# EAGLE design Murray (EAGLE 7.7.0)
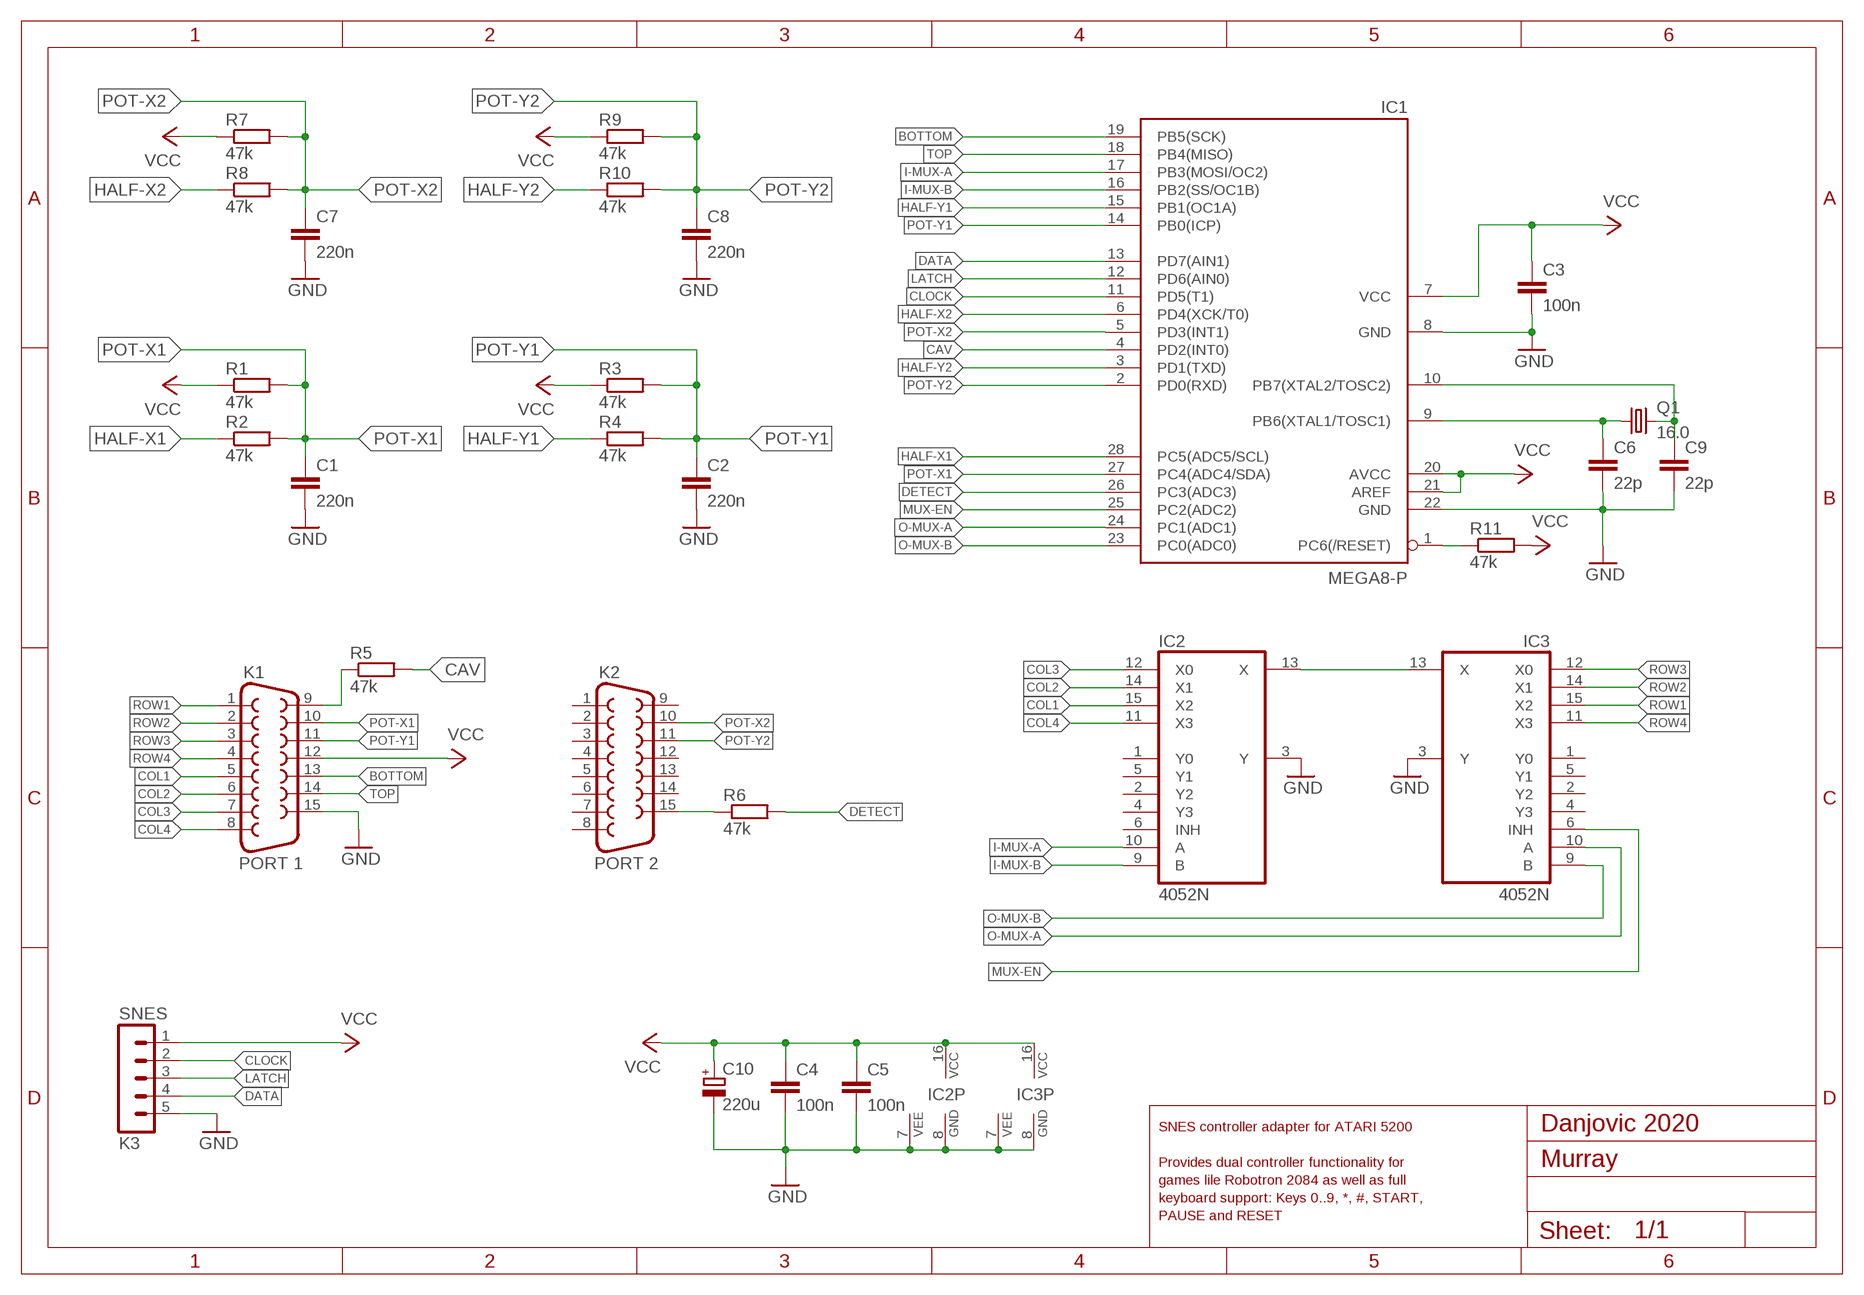
[diagram p0: schematic, sheet 1]

## Parts
C1  220n  C-EU050-030X075  [C050-030X075]
C2  220n  C-EU050-030X075  [C050-030X075]
C3  100n  C-EU050-024X044  [C050-024X044]
C4  100n  C-EU050-024X044  [C050-024X044]
C5  100n  C-EU050-024X044  [C050-024X044]
C6  22p  C-EU025-024X044  [C025-024X044]
C7  220n  C-EU050-030X075  [C050-030X075]
C8  220n  C-EU050-030X075  [C050-030X075]
C9  22p  C-EU025-024X044  [C025-024X044]
C10  220u  CPOL-EUE2,5-6E  [E2,5-6E]
IC1  MEGA8-P  [DIL28-3]
IC2  4052N  [DIL16]
IC3  4052N  [DIL16]
K1  PORT 1  F15H  [F15H]
K2  PORT 2  F15H  [F15H]
K3  SNES  MA05-1  [MA05-1]
Q1  16.0  CRYSTALTC26V  [TC26V]
R1  47k  R-EU_0204/7  [0204/7]
R2  47k  R-EU_0204/7  [0204/7]
R3  47k  R-EU_0204/7  [0204/7]
R4  47k  R-EU_0204/7  [0204/7]
R5  47k  R-EU_0204/7  [0204/7]
R6  47k  R-EU_0204/7  [0204/7]
R7  47k  R-EU_0204/7  [0204/7]
R8  47k  R-EU_0204/7  [0204/7]
R9  47k  R-EU_0204/7  [0204/7]
R10  47k  R-EU_0204/7  [0204/7]
R11  47k  R-EU_0204/7  [0204/7]

## Nets
BOTTOM: IC1.19(PB5(SCK)) K1.13
CAV: IC1.4(PD2(INT0)) R5.2
CLOCK: IC1.11(PD5(T1)) K3.2
COL1: IC2.15(X2) K1.5
COL2: IC2.14(X1) K1.6
COL3: IC2.12(X0) K1.7
COL4: IC2.11(X3) K1.8
DATA: IC1.13(PD7(AIN1)) K3.4
DETECT: IC1.26(PC3(ADC3)) R6.2
GND: C1.2 C2.2 C3.2 C4.2 C5.2 C6.2 C7.2 C8.2 C9.2 C10.- IC1.8(GND) IC1.22(GND) IC2.3(Y) IC2.7(VEE) IC2.8(GND) IC3.3(Y) IC3.7(VEE) IC3.8(GND) K1.15 K3.5
HALF-X1: IC1.28(PC5(ADC5/SCL)) R2.1
HALF-X2: IC1.6(PD4(XCK/T0)) R8.1
HALF-Y1: IC1.15(PB1(OC1A)) R4.1
HALF-Y2: IC1.3(PD1(TXD)) R10.1
I-MUX-A: IC1.17(PB3(MOSI/OC2)) IC2.10(A)
I-MUX-B: IC1.16(PB2(SS/OC1B)) IC2.9(B)
LATCH: IC1.12(PD6(AIN0)) K3.3
MUX-EN: IC1.25(PC2(ADC2)) IC3.6(INH)
N$1: K2.15 R6.1
N$2: IC2.13(X) IC3.13(X)
N$3: IC1.1(PC6(/RESET)) R11.1
N$19: K1.9 R5.1
O-MUX-A: IC1.24(PC1(ADC1)) IC3.10(A)
O-MUX-B: IC1.23(PC0(ADC0)) IC3.9(B)
POT-X1: C1.1 IC1.27(PC4(ADC4/SDA)) K1.10 R1.2 R2.2
POT-X2: C7.1 IC1.5(PD3(INT1)) K2.10 R7.2 R8.2
POT-Y1: C2.1 IC1.14(PB0(ICP)) K1.11 R3.2 R4.2
POT-Y2: C8.1 IC1.2(PD0(RXD)) K2.11 R9.2 R10.2
ROW1: IC3.15(X2) K1.1
ROW2: IC3.14(X1) K1.2
ROW3: IC3.12(X0) K1.3
ROW4: IC3.11(X3) K1.4
TOP: IC1.18(PB4(MISO)) K1.14
VCC: C3.1 C4.1 C5.1 C10.+ IC1.7(VCC) IC1.20(AVCC) IC1.21(AREF) IC2.16(VCC) IC3.16(VCC) K1.12 K3.1 R1.1 R3.1 R7.1 R9.1 R11.2
XT1: C6.1 IC1.9(PB6(XTAL1/TOSC1)) Q1.1
XT2: C9.1 IC1.10(PB7(XTAL2/TOSC2)) Q1.2
Unconnected: IC2.1(Y0) IC2.2(Y2) IC2.4(Y3) IC2.5(Y1) IC2.6(INH) IC3.1(Y0) IC3.2(Y2) IC3.4(Y3) IC3.5(Y1) K2.1 K2.2 K2.3 K2.4 K2.5 K2.6 K2.7 K2.8 K2.9 K2.12 K2.13 K2.14

## Notes on the sheet
- SNES controller adapter for ATARI 5200 | Danjovic 2020
- Provides dual controller functionality for
- games lile Robotron 2084 as well as full
- keyboard support: Keys 0..9, *, #, START,
- PAUSE and RESET

## Library data of the parts
C1-C9 = rcl:C-EU: CAPACITOR, European symbol
C10 = rcl:CPOL-EU: POLARIZED CAPACITOR, European symbol
IC1 = atmel:MEGA8-P: MICROCONTROLLER 8 Kbytes FLASH, 1 kbytes SRAM, 512 bytes EEPROM, USART, 4-channel 10 bit ADC, 2-channel 8 bit ADC Pin compatible with Atmega48, ATMega88, ATMega168 Source: avr.lbr; OC_FARNELL: unknown; OC_NEWARK: unknown
IC2 IC3 = 40xx:4052: Dual 4-channel ANALOG MULTIPLEXER
K1 K2 = con-subd:F15: SUB-D; OC_FARNELL: unknown; OC_NEWARK: unknown
K3 = con-lstb:MA05-1: PIN HEADER; OC_FARNELL: unknown; OC_NEWARK: unknown
Q1 = crystal:CRYSTAL: CRYSTAL; OC_FARNELL: unknown; OC_NEWARK: unknown
R1-R11 = rcl:R-EU_: RESISTOR, European symbol

## Board
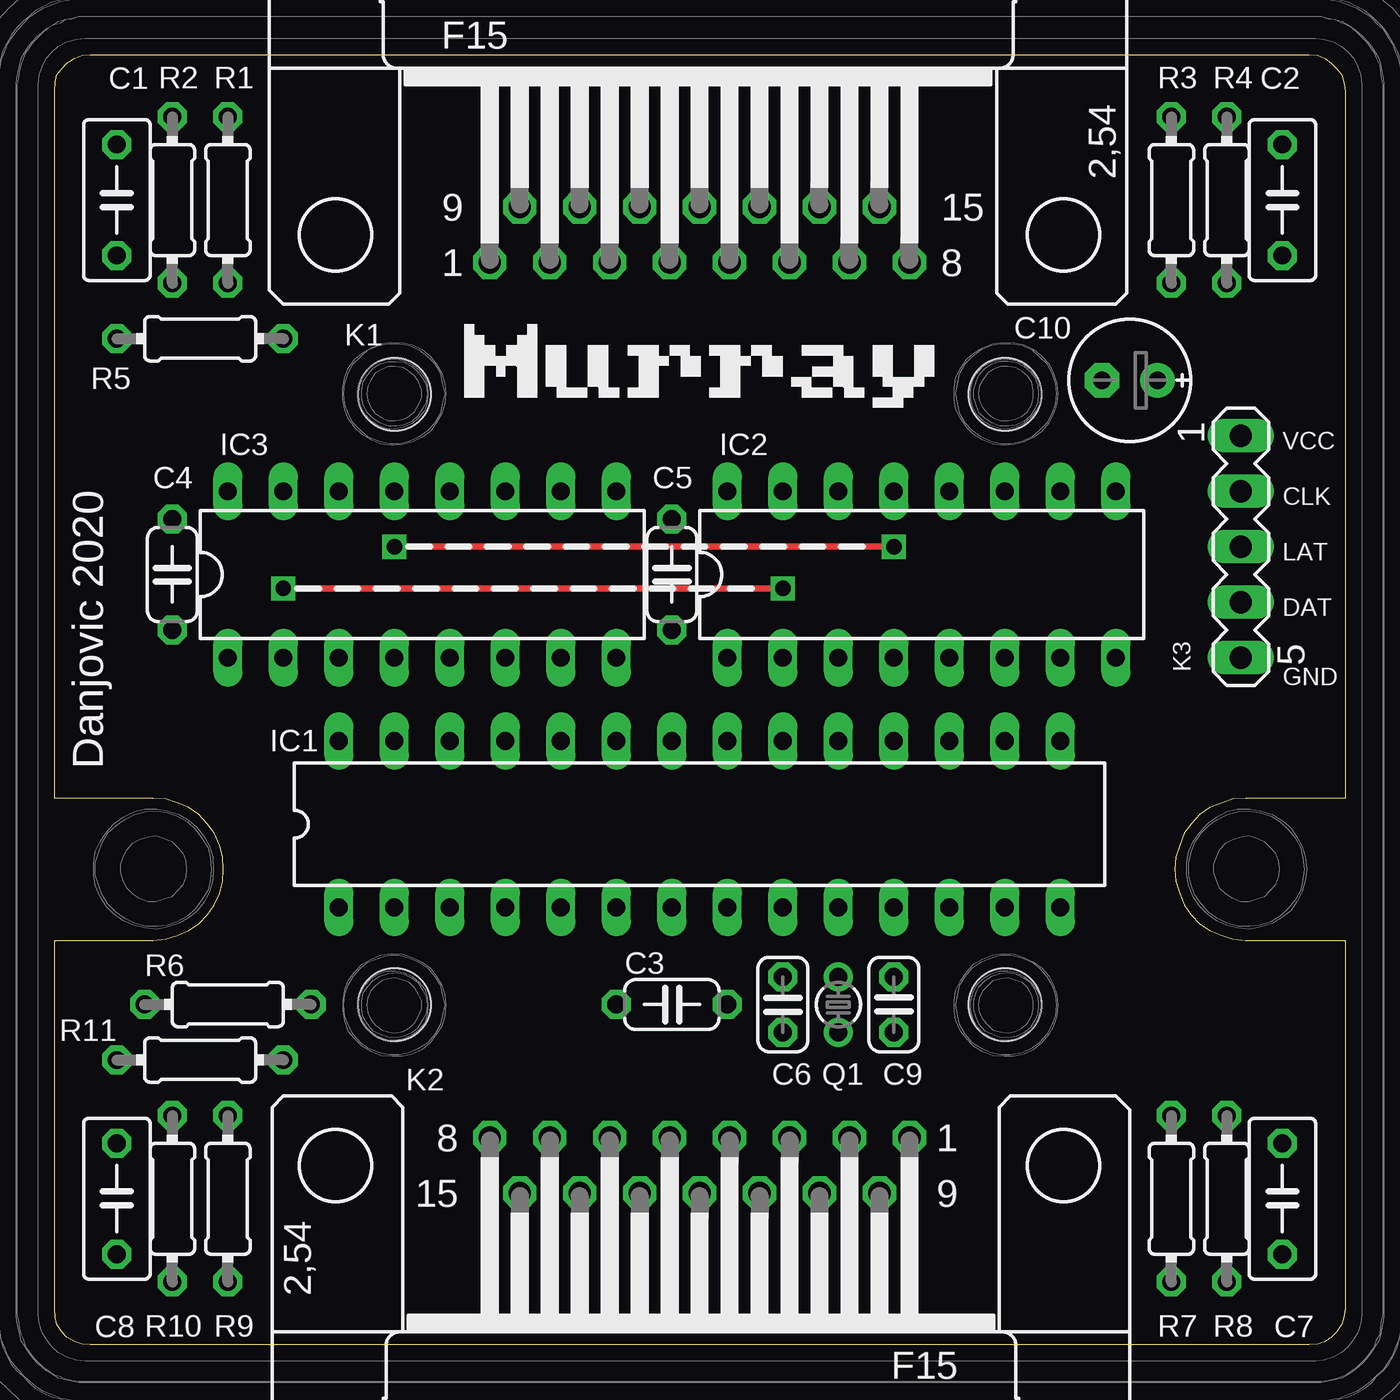
[diagram p1: board, top side]
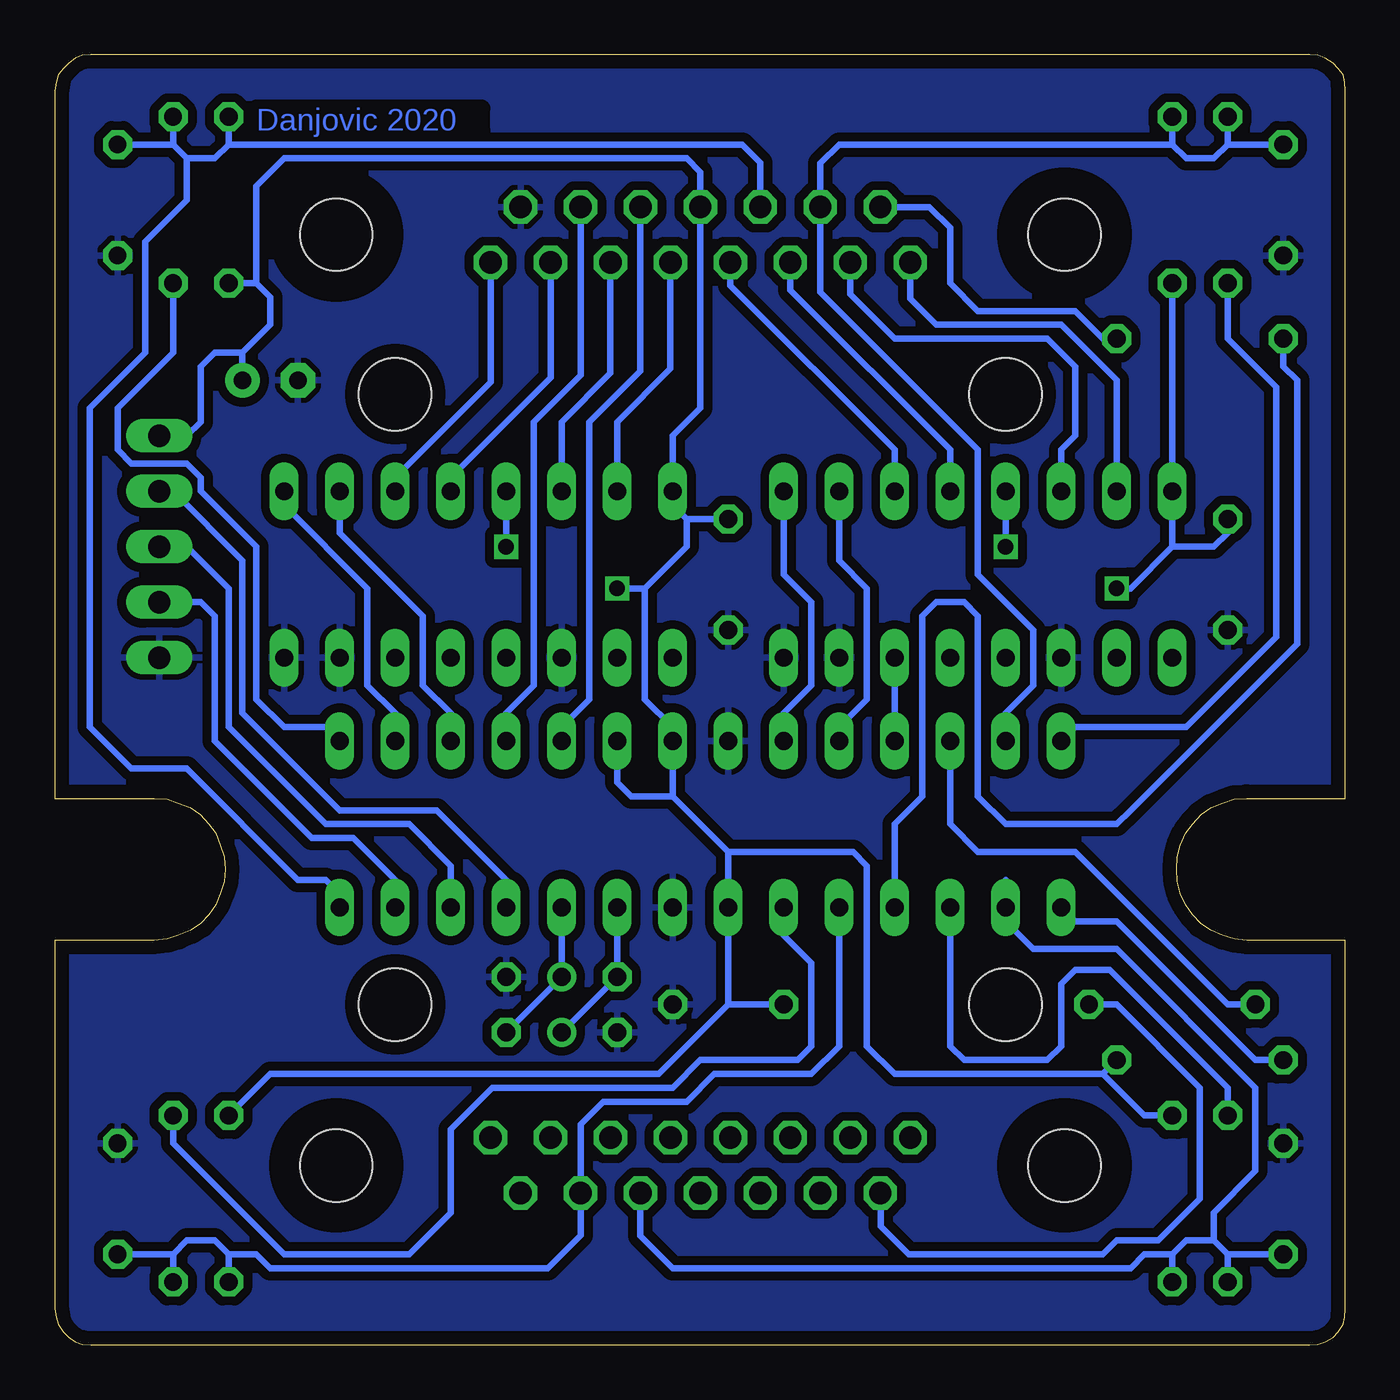
[diagram p2: board, bottom side, seen from below]

Size 59.07 x 59.07 mm. Coordinates in mm from the lower left corner, seen from the top.
Copper layers (1*16): Top 0.035mm / dielectric 1.5mm / Bottom 0.035mm
Design rules "default *": minimum track width 10mil, minimum drill 24mil, track to track 8mil, track to pad 8mil, pad to pad 8mil, via to via 8mil, smd to smd 8mil, copper to edge 25mil, drill to drill 8mil, minimum pad ring 10mil, minimum via ring 8mil, stop-mask expansion 4mil, vias tented up to drill 0mil, thermal gap 10mil

### Footprints (pad centres in the part's own frame; a part is rotated, then mirrored left to right if it is on the bottom)
C050-030X075 = drill 0.813 octagon: 1 -2.54,0; 2 2.54,0
C050-024X044 = drill 0.813 octagon: 1 -2.54,0; 2 2.54,0
C025-024X044 = drill 0.813 octagon: 1 -1.27,0; 2 1.27,0
E2,5-6E = drill 0.813 pad 1.575: + -1.27,0 | drill 0.813 pad 1.575 octagon: - 1.27,0
DIL28-3 = drill 0.813 long: 1 -16.51,-3.81; 2 -13.97,-3.81; 3 -11.43,-3.81; 4 -8.89,-3.81; 5 -6.35,-3.81; 6 -3.81,-3.81; 7 -1.27,-3.81; 8 1.27,-3.81; 9 3.81,-3.81; 10 6.35,-3.81; 11 8.89,-3.81; 12 11.43,-3.81; 13 13.97,-3.81; 14 16.51,-3.81; 15 16.51,3.81; 16 13.97,3.81; 17 11.43,3.81; 18 8.89,3.81; 19 6.35,3.81; 20 3.81,3.81; 21 1.27,3.81; 22 -1.27,3.81; 23 -3.81,3.81; 24 -6.35,3.81; 25 -8.89,3.81; 26 -11.43,3.81; 27 -13.97,3.81; 28 -16.51,3.81
DIL16 = drill 0.813 long: 1 -8.89,-3.81; 2 -6.35,-3.81; 3 -3.81,-3.81; 4 -1.27,-3.81; 5 1.27,-3.81; 6 3.81,-3.81; 7 6.35,-3.81; 8 8.89,-3.81; 9 8.89,3.81; 10 6.35,3.81; 11 3.81,3.81; 12 1.27,3.81; 13 -1.27,3.81; 14 -3.81,3.81; 15 -6.35,3.81; 16 -8.89,3.81
F15H = drill 1.016 octagon: 1 -9.601,-1.27; 2 -6.858,-1.27; 3 -4.115,-1.27; 4 -1.372,-1.27; 5 1.372,-1.27; 6 4.115,-1.27; 7 6.858,-1.27; 8 9.601,-1.27; 9 -8.23,1.27; 10 -5.486,1.27; 11 -2.743,1.27; 12 0,1.27; 13 2.743,1.27; 14 5.486,1.27; 15 8.23,1.27 | hole 3.302: -16.662,0; 16.662,0
MA05-1 = drill 1.016 long: 1 -5.08,0; 2 -2.54,0; 3 0,0; 4 2.54,0; 5 5.08,0
TC26V = drill 0.813: 1 -1.27,0; 2 1.27,0
0204/7 = drill 0.813 octagon: 1 -3.81,0; 2 3.81,0
1593J = hole 3.302: -13.97,-13.97; 13.97,-13.97; -13.97,13.97; 13.97,13.97

### Placement (x,y rotation side)
C1  2.85,52.41 270 top
C2  56.19,52.41 270 top
C3  28.25,15.58 0 top
C4  5.39,35.27 270 top
C5  28.25,35.27 270 top
C6  33.33,15.58 270 top
C7  56.19,6.69 90 top
C8  2.85,6.69 90 top
C9  38.41,15.58 90 top
C10  49.2,44.16 180 top
IC1  29.52,23.84 0 top
IC2  39.68,35.27 0 top
IC3  16.82,35.27 0 top
K1  29.52,50.82 0 top
K2  29.52,8.22 180 top
K3  54.28,36.54 270 top
Q1  35.87,15.58 90 top
R1  7.93,52.41 90 top
R2  5.39,52.41 90 top
R3  51.11,52.41 90 top
R4  53.65,52.41 90 top
R5  6.66,46.06 180 top
R6  7.93,15.58 180 top
R7  51.11,6.69 270 top
R8  53.65,6.69 270 top
R9  7.93,6.69 270 top
R10  5.39,6.69 270 top
R11  6.66,13.04 0 top
U$1  [1593J]  29.52,29.55 0 top

### Tracks (layer width: path | path; a pad name or v marks a point on that pad's centre or on a via)
BOTTOM
  Bottom 0.305: K1.13 32.26,44.59 34.6,42.25 34.6,29.55 35.87,28.28 IC1.19
CAV
  Bottom 0.305: R5.2 2.85,44.79 2.21,44.16 2.21,32.09 9.83,24.47 10.47,23.84 15.55,23.84 16.82,25.11 16.82,33.36 17.45,34 18.72,34 19.36,33.36 19.36,25.11 20.63,23.84 IC1.4
CLOCK
  Bottom 0.305: K3.2 53.65,39.08 50.47,35.9 50.47,28.92 46.03,24.47 41.58,24.47 38.41,21.3 IC1.11
COL1
  Bottom 0.305: K1.5 30.89,44.69 33.33,42.25 IC2.15
COL2
  Bottom 0.305: K1.6 33.63,44.49 35.87,42.25 IC2.14
COL3
  Bottom 0.305: K1.7 36.38,44.28 40.95,39.71 IC2.12
COL4
  Bottom 0.305: K1.8 39.12,44.08 43.49,39.71 IC2.11
DATA
  Bottom 0.305: K3.4 52.38,34 51.74,33.36 51.74,27.65 47.3,23.2 45.39,23.2 43.49,21.3 IC1.13
DETECT
  Bottom 0.305: IC1.26 18.09,23.84 16.82,22.57 12.37,22.57 5.39,15.58 R6.2
GND
  pour Bottom (isolate 0.406): -0.96,-0.93 -0.96,60.03 60,60.03 60,-0.93
HALF-X1
  Bottom 0.305: R2.1 5.39,46.06 3.17,43.84 3.17,32.41 7.29,28.28 12.37,28.28 IC1.28
HALF-X2
  Bottom 0.305: IC1.6 25.71,18.76 24.44,17.49 24.44,13.68 25.07,13.04 29.52,13.04 30.79,11.77 39.04,11.77 40.95,9.87 40.95,6.06 42.85,4.15 48.57,4.15 53.65,9.23 R8.1
HALF-Y1
  Bottom 0.305: R4.1 53.65,45.43 56.19,42.89 56.19,40.98 55.55,40.35 53.01,40.35 52.38,39.71 52.38,39.08 49.84,36.54 49.84,29.55 48.57,28.28 46.66,28.28 IC1.15 46.03,27.01
HALF-Y2
  Bottom 0.305: IC1.3 18.09,13.68 17.45,13.04 13.64,13.04 13.01,13.68 13.01,16.53 12.37,17.17 10.79,17.17 5.39,11.77 R10.1
I-MUX-A
  Bottom 0.305: IC1.17 40.95,28.92 42.22,30.19 42.22,33.36 46.03,37.17 IC2.10
I-MUX-B
  Bottom 0.305: IC2.9 48.57,38.44 44.76,34.63 44.76,30.19 43.49,28.92 IC1.16
LATCH
  Bottom 0.305: K3.3 53.01,36.54 51.11,34.63 51.11,28.28 46.66,23.84 42.85,23.84 40.95,21.93 IC1.12
MUX-EN
  Bottom 0.305: IC3.6 IC1.25
N$1
  Bottom 0.305: K2.15 21.26,6.92 21.26,5.42 20.63,4.79 19.99,4.15 11.1,4.15 10.47,4.79 8.56,4.79 6.66,6.69 6.66,11.77 10.47,15.58 R6.1
N$2  (via drill 0.7)
  Top 0.305: v15.55,36.54 v38.41,36.54
  Bottom 0.305: IC3.13 v15.55,36.54 | v38.41,36.54 IC2.13
N$3
  Bottom 0.305: IC1.1 12.37,19.39 10.47,19.39 4.12,13.04 R11.1
N$19
  Bottom 0.305: R5.1 11.1,46.06 12.37,47.33 16.82,47.33 18.09,48.6 18.09,51.14 19.04,52.09 K1.9
O-MUX-A
  Bottom 0.305: IC3.10 23.17,35.9 21.9,34.63 21.9,29.55 23.17,28.28 IC1.24
O-MUX-B
  Bottom 0.305: IC3.9 25.71,35.27 24.44,34 24.44,30.19 25.71,28.92 IC1.23
POT-X1
  Bottom 0.305: R2.2 5.39,54.95 | 5.39,54.95 C1.1 | R1.2 7.93,54.95 | 7.93,54.95 7.29,54.32 6.02,54.32 5.39,54.95 | 7.93,54.95 23.17,54.95 24.03,54.09 K1.10 24.03,48.2 16.82,40.98 16.82,35.27 14.28,32.73 14.28,30.19 15.55,28.92 IC1.27
POT-X2
  Bottom 0.305: C7.1 53.65,4.15 | 53.65,4.15 R8.2 | R7.2 51.11,4.15 | 51.11,4.15 51.74,4.79 53.01,4.79 53.65,4.15 | 51.11,4.15 49.84,4.15 49.2,3.52 36.5,3.52 35.87,4.15 35,5.02 K2.10 35,10.1 33.96,11.14 30.15,11.14 28.88,12.41 24.44,12.41 23.17,13.68 IC1.5
POT-Y1
  Bottom 0.305: C2.1 53.65,54.95 | 53.65,54.95 R4.2 | R3.2 51.11,54.95 | 51.11,54.95 51.74,54.32 53.01,54.32 | 53.01,54.32 53.65,54.95 | 51.11,54.95 27.61,54.95 26.77,54.11 K1.11 | 53.01,54.32 53.01,52.41 54.92,50.51 54.92,45.43 57.46,42.89 57.46,28.28 55.55,26.38 53.01,26.38 47.93,21.3 46.66,21.3 46.03,20.66 IC1.14
POT-Y2
  Bottom 0.305: C8.1 5.39,4.15 | 7.93,4.15 7.29,4.79 6.02,4.79 | 6.02,4.79 5.39,4.15 | 7.93,4.15 9.2,4.15 9.83,3.52 30.79,3.52 32.26,4.99 K2.11 | 15.55,21.3 IC1.2 15.55,19.39 14.28,18.12 10.47,18.12 4.12,11.77 4.12,7.96 6.02,6.06 6.02,4.79 | R10.2 5.39,4.15 | 7.93,4.15 R9.2
ROW1
  Bottom 0.305: IC3.15 10.47,44.16 13.01,46.7 18.72,46.7 19.92,47.89 K1.1
ROW2
  Bottom 0.305: K1.2 22.66,48.09 20.63,46.06 13.64,46.06 12.37,44.79 12.37,41.62 13.01,40.98 IC3.14
ROW3
  Bottom 0.305: IC3.12 18.09,40.98 25.4,48.3 K1.3
ROW4
  Bottom 0.305: K1.4 28.15,48.5 20.63,40.98 IC3.11
TOP
  Bottom 0.305: K1.14 35,44.39 37.14,42.25 37.14,30.19 38.41,28.92 IC1.18
VCC  (via drill 0.7)
  Top 0.305: v10.47,34.63 v33.33,34.63
  Bottom 0.305: C5.1 30.15,37.81 | 30.15,37.81 30.79,38.44 IC2.16 30.79,41.62 29.52,42.89 K1.12 29.52,53.68 30.15,54.32 48.57,54.32 49.84,53.05 49.84,48.6 | 28.25,15.58 IC1.7 28.25,22.57 | 30.79,25.11 IC1.21 30.79,28.28 32.06,29.55 32.06,34.63 | 30.79,25.11 28.25,22.57 | IC1.20 33.33,25.74 32.69,25.11 30.79,25.11 | v33.33,34.63 32.06,34.63 | 32.06,34.63 30.15,36.54 30.15,37.81 | R1.1 IC3.16 7.93,36.54 | R7.1 49.2,12.41 31.42,12.41 28.25,15.58 | K3.1 53.01,41.62 52.38,42.25 52.38,44.79 51.74,45.43 50.47,45.43 | 7.93,36.54 9.83,34.63 v10.47,34.63 | C3.1 28.25,15.58 | 49.84,48.6 49.2,47.97 49.2,46.7 50.47,45.43 | 50.47,45.43 C10.+ | 49.84,48.6 R3.1 | C4.1 5.39,37.17 6.02,36.54 7.93,36.54 | 11.1,12.41 9.2,10.5 R9.1 | 11.1,12.41 20.63,12.41 21.9,13.68 21.9,21.93 22.53,22.57 28.25,22.57 | R11.2 11.1,12.41
XT1
  Bottom 0.305: IC1.9 C6.1 Q1.1
XT2
  Bottom 0.305: IC1.10 Q1.2 C9.1
(copper drawn outside any net)
  shapes: Top area x696

### Text on the board
Bottom: Danjovic 2020
tPlace: VCC | CLK | LAT | DAT | GND | Danjovic 2020